# EAGLE schematic carousel (EAGLE 9.2.2)
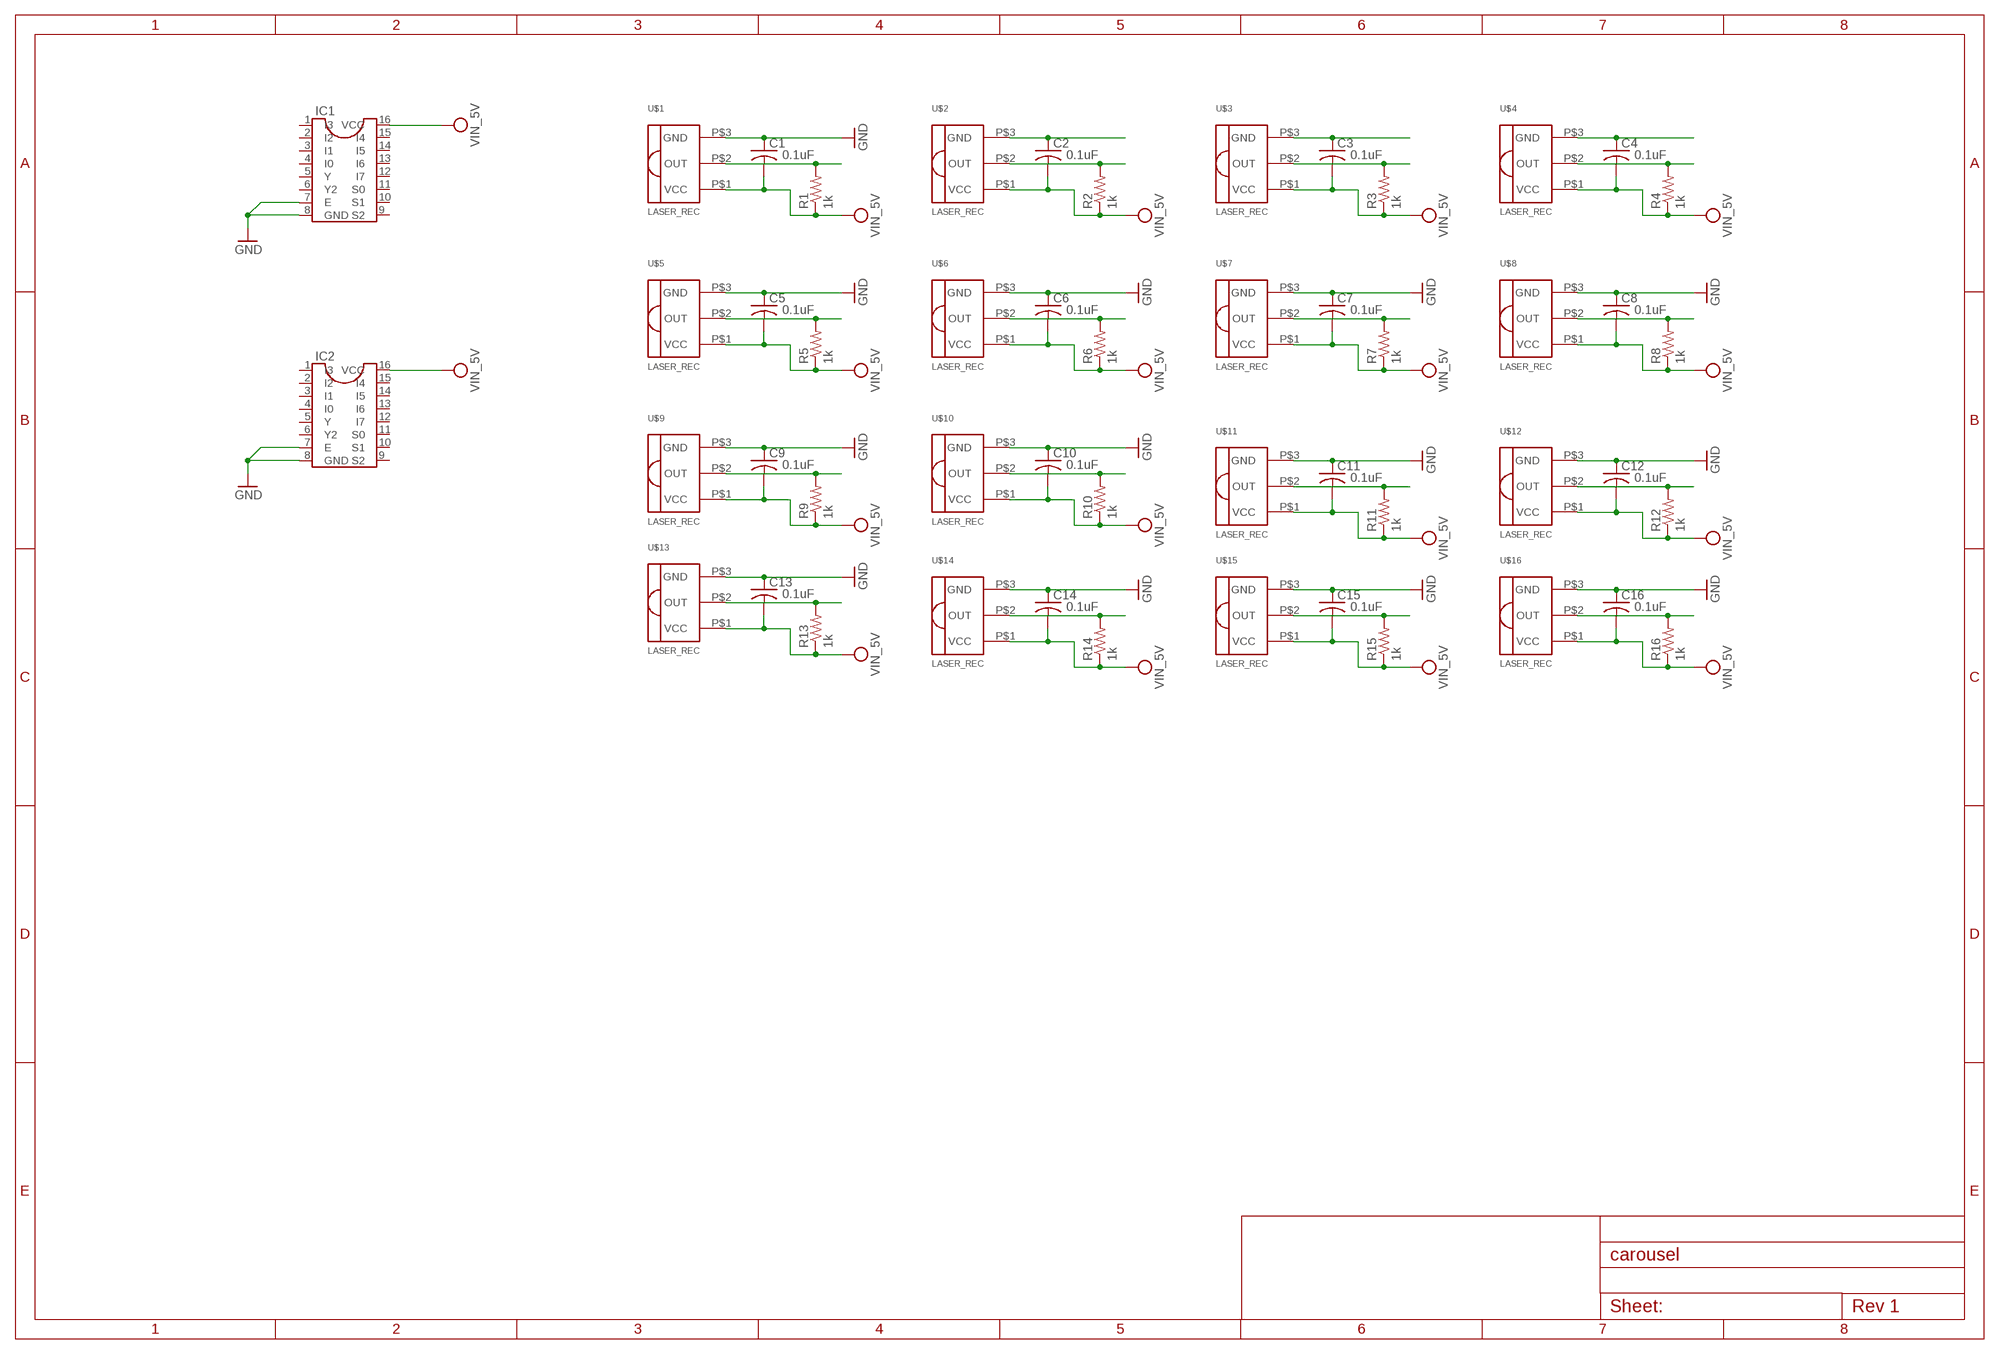
[diagram p0: schematic, sheet 1]

## Parts
C1  0.1uF  C-US025-024X044  [C025-024X044]
C2  0.1uF  C-US025-024X044  [C025-024X044]
C3  0.1uF  C-US025-024X044  [C025-024X044]
C4  0.1uF  C-US025-024X044  [C025-024X044]
C5  0.1uF  C-US025-024X044  [C025-024X044]
C6  0.1uF  C-US025-024X044  [C025-024X044]
C7  0.1uF  C-US025-024X044  [C025-024X044]
C8  0.1uF  C-US025-024X044  [C025-024X044]
C9  0.1uF  C-US025-024X044  [C025-024X044]
C10  0.1uF  C-US025-024X044  [C025-024X044]
C11  0.1uF  C-US025-024X044  [C025-024X044]
C12  0.1uF  C-US050-024X044  [C050-024X044]
C13  0.1uF  C-US025-024X044  [C025-024X044]
C14  0.1uF  C-US025-024X044  [C025-024X044]
C15  0.1uF  C-US025-024X044  [C025-024X044]
C16  0.1uF  C-US025-024X044  [C025-024X044]
IC1  CD74HCT151S  [CD74HCT151]
IC2  CD74HCT151S  [CD74HCT151]
R1  1k  R-US_0204/2V  [0204V]
R2  1k  R-US_0204/2V  [0204V]
R3  1k  R-US_0204/2V  [0204V]
R4  1k  R-US_0204/2V  [0204V]
R5  1k  R-US_0204/2V  [0204V]
R6  1k  R-US_0204/2V  [0204V]
R7  1k  R-US_0204/2V  [0204V]
R8  1k  R-US_0204/2V  [0204V]
R9  1k  R-US_0204/2V  [0204V]
R10  1k  R-US_0204/2V  [0204V]
R11  1k  R-US_0204/2V  [0204V]
R12  1k  R-US_0204/2V  [0204V]
R13  1k  R-US_0204/2V  [0204V]
R14  1k  R-US_0204/2V  [0204V]
R15  1k  R-US_0204/2V  [0204V]
R16  1k  R-US_0204/2V  [0204V]
U$1  LASER_REC  [LSR_RC]
U$2  LASER_REC  [LSR_RC]
U$3  LASER_REC  [LSR_RC]
U$4  LASER_REC  [LSR_RC]
U$5  LASER_REC  [LSR_RC]
U$6  LASER_REC  [LSR_RC]
U$7  LASER_REC  [LSR_RC]
U$8  LASER_REC  [LSR_RC]
U$9  LASER_REC  [LSR_RC]
U$10  LASER_REC  [LSR_RC]
U$11  LASER_REC  [LSR_RC]
U$12  LASER_REC  [LSR_RC]
U$13  LASER_REC  [LSR_RC]
U$14  LASER_REC  [LSR_RC]
U$15  LASER_REC  [LSR_RC]
U$16  LASER_REC  [LSR_RC]

## Nets
GND: C1.1 C5.1 C6.1 C7.1 C8.1 C9.1 C10.1 C11.1 C12.1 C13.1 C14.1 C15.1 C16.1 IC1.7(E) IC1.8(GND) IC2.7(E) IC2.8(GND) U$1.P$3(GND) U$5.P$3(GND) U$6.P$3(GND) U$7.P$3(GND) U$8.P$3(GND) U$9.P$3(GND) U$10.P$3(GND) U$11.P$3(GND) U$12.P$3(GND) U$13.P$3(GND) U$14.P$3(GND) U$15.P$3(GND) U$16.P$3(GND)
N$2: R13.2 U$13.P$2(OUT)
N$3: R1.2 U$1.P$2(OUT)
N$4: C2.1 U$2.P$3(GND)
N$6: R2.2 U$2.P$2(OUT)
N$7: C3.1 U$3.P$3(GND)
N$9: R3.2 U$3.P$2(OUT)
N$10: C4.1 U$4.P$3(GND)
N$12: R4.2 U$4.P$2(OUT)
N$15: R5.2 U$5.P$2(OUT)
N$18: R6.2 U$6.P$2(OUT)
N$21: R7.2 U$7.P$2(OUT)
N$24: R8.2 U$8.P$2(OUT)
N$27: R9.2 U$9.P$2(OUT)
N$30: R10.2 U$10.P$2(OUT)
N$33: R11.2 U$11.P$2(OUT)
N$36: R12.2 U$12.P$2(OUT)
N$42: R14.2 U$14.P$2(OUT)
N$45: R15.2 U$15.P$2(OUT)
N$48: R16.2 U$16.P$2(OUT)
VIN_5V: C1.2 C2.2 C3.2 C4.2 C5.2 C6.2 C7.2 C8.2 C9.2 C10.2 C11.2 C12.2 C13.2 C14.2 C15.2 C16.2 IC1.16(VCC) IC2.16(VCC) R1.1 R2.1 R3.1 R4.1 R5.1 R6.1 R7.1 R8.1 R9.1 R10.1 R11.1 R12.1 R13.1 R14.1 R15.1 R16.1 U$1.P$1(VCC) U$2.P$1(VCC) U$3.P$1(VCC) U$4.P$1(VCC) U$5.P$1(VCC) U$6.P$1(VCC) U$7.P$1(VCC) U$8.P$1(VCC) U$9.P$1(VCC) U$10.P$1(VCC) U$11.P$1(VCC) U$12.P$1(VCC) U$13.P$1(VCC) U$14.P$1(VCC) U$15.P$1(VCC) U$16.P$1(VCC)
Unconnected: IC1.1(I3) IC1.2(I2) IC1.3(I1) IC1.4(I0) IC1.5(Y) IC1.6(Y2) IC1.9(S2) IC1.10(S1) IC1.11(S0) IC1.12(I7) IC1.13(I6) IC1.14(I5) IC1.15(I4) IC2.1(I3) IC2.2(I2) IC2.3(I1) IC2.4(I0) IC2.5(Y) IC2.6(Y2) IC2.9(S2) IC2.10(S1) IC2.11(S0) IC2.12(I7) IC2.13(I6) IC2.14(I5) IC2.15(I4)

## Library data of the parts
C1-C16 = adafruit:C-US: CAPACITOR, American symbol
IC1 IC2 = ENGI301:CD74HCT151: Dual In Line / Socket
R1-R16 = adafruit:R-US_: RESISTOR, American symbol
U$1-U$16 = ENGI301:LASER_REC